# EAGLE schematic EIT_Recorder (EAGLE 9.6.2)

## Sheet 1 of 4: POWER_MANAGEMENT_1
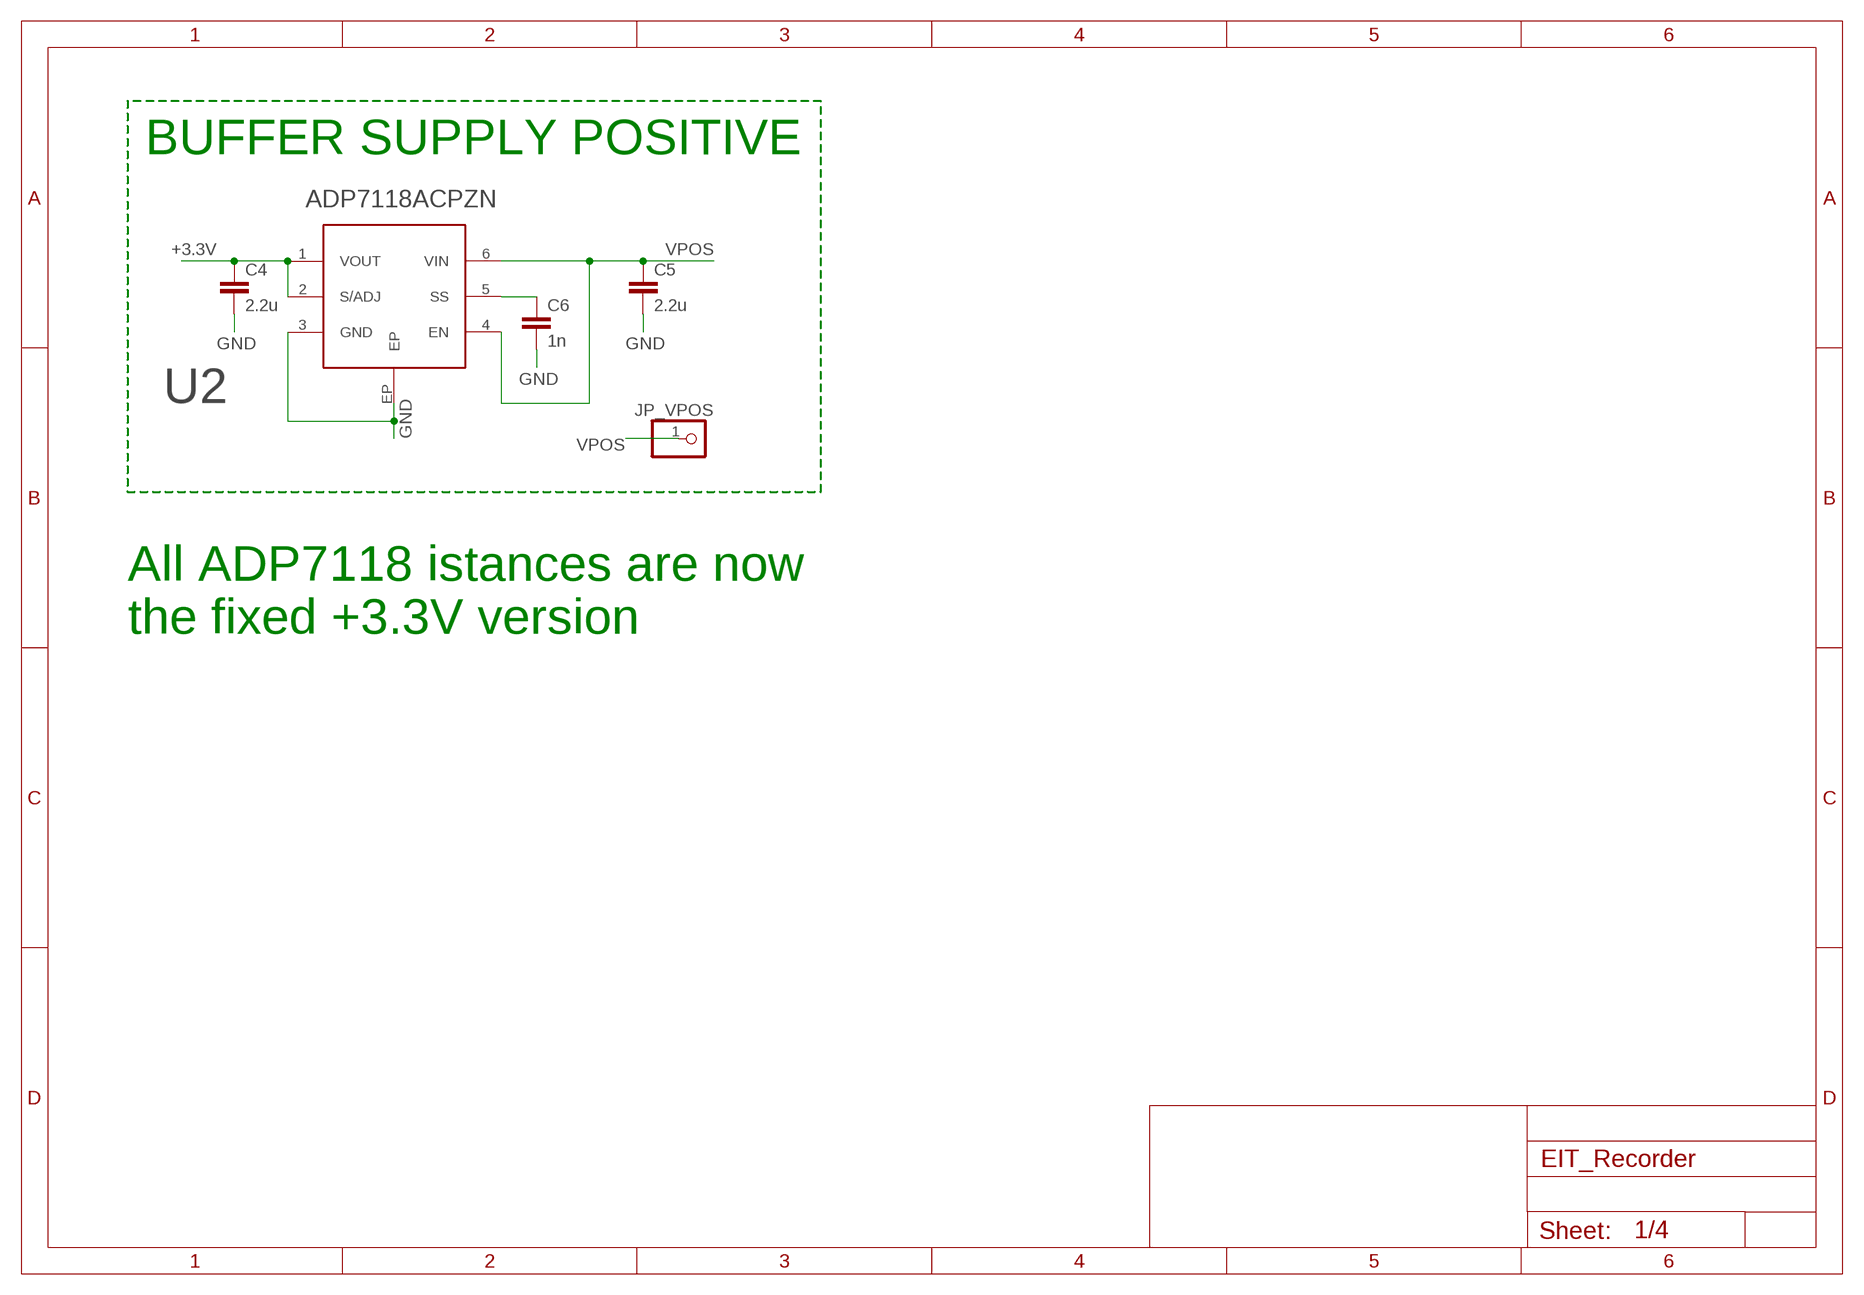
[diagram p0: schematic, sheet 1]

### Parts
C4  2.2u  C0603  [C0603]
C5  2.2u  C0603  [C0603]
C6  1n  C0402  [C0402]
JP_VPOS  PINHD-1X1  [1X01]
U2  ADP7118ACPZN  [LFCSP6_CUSTOM]

### Nets
+3.3V: C4.1 U2.1(VOUT) U2.2(S/ADJ) ; also sheet 3
GND: C4.2 C5.2 C6.2 U2.3(GND) U2.EP ; also sheet 2,3,4
N$7: C6.1 U2.5(SS)
VPOS: C5.1 JP_VPOS.1 U2.4(EN) U2.6(VIN) ; also sheet 2,4

### Notes on the sheet
- BUFFER SUPPLY POSITIVE
- All ADP7118 istances are now
  the fixed +3.3V version

## Sheet 2 of 4: POWER_MANAGEMENT_2
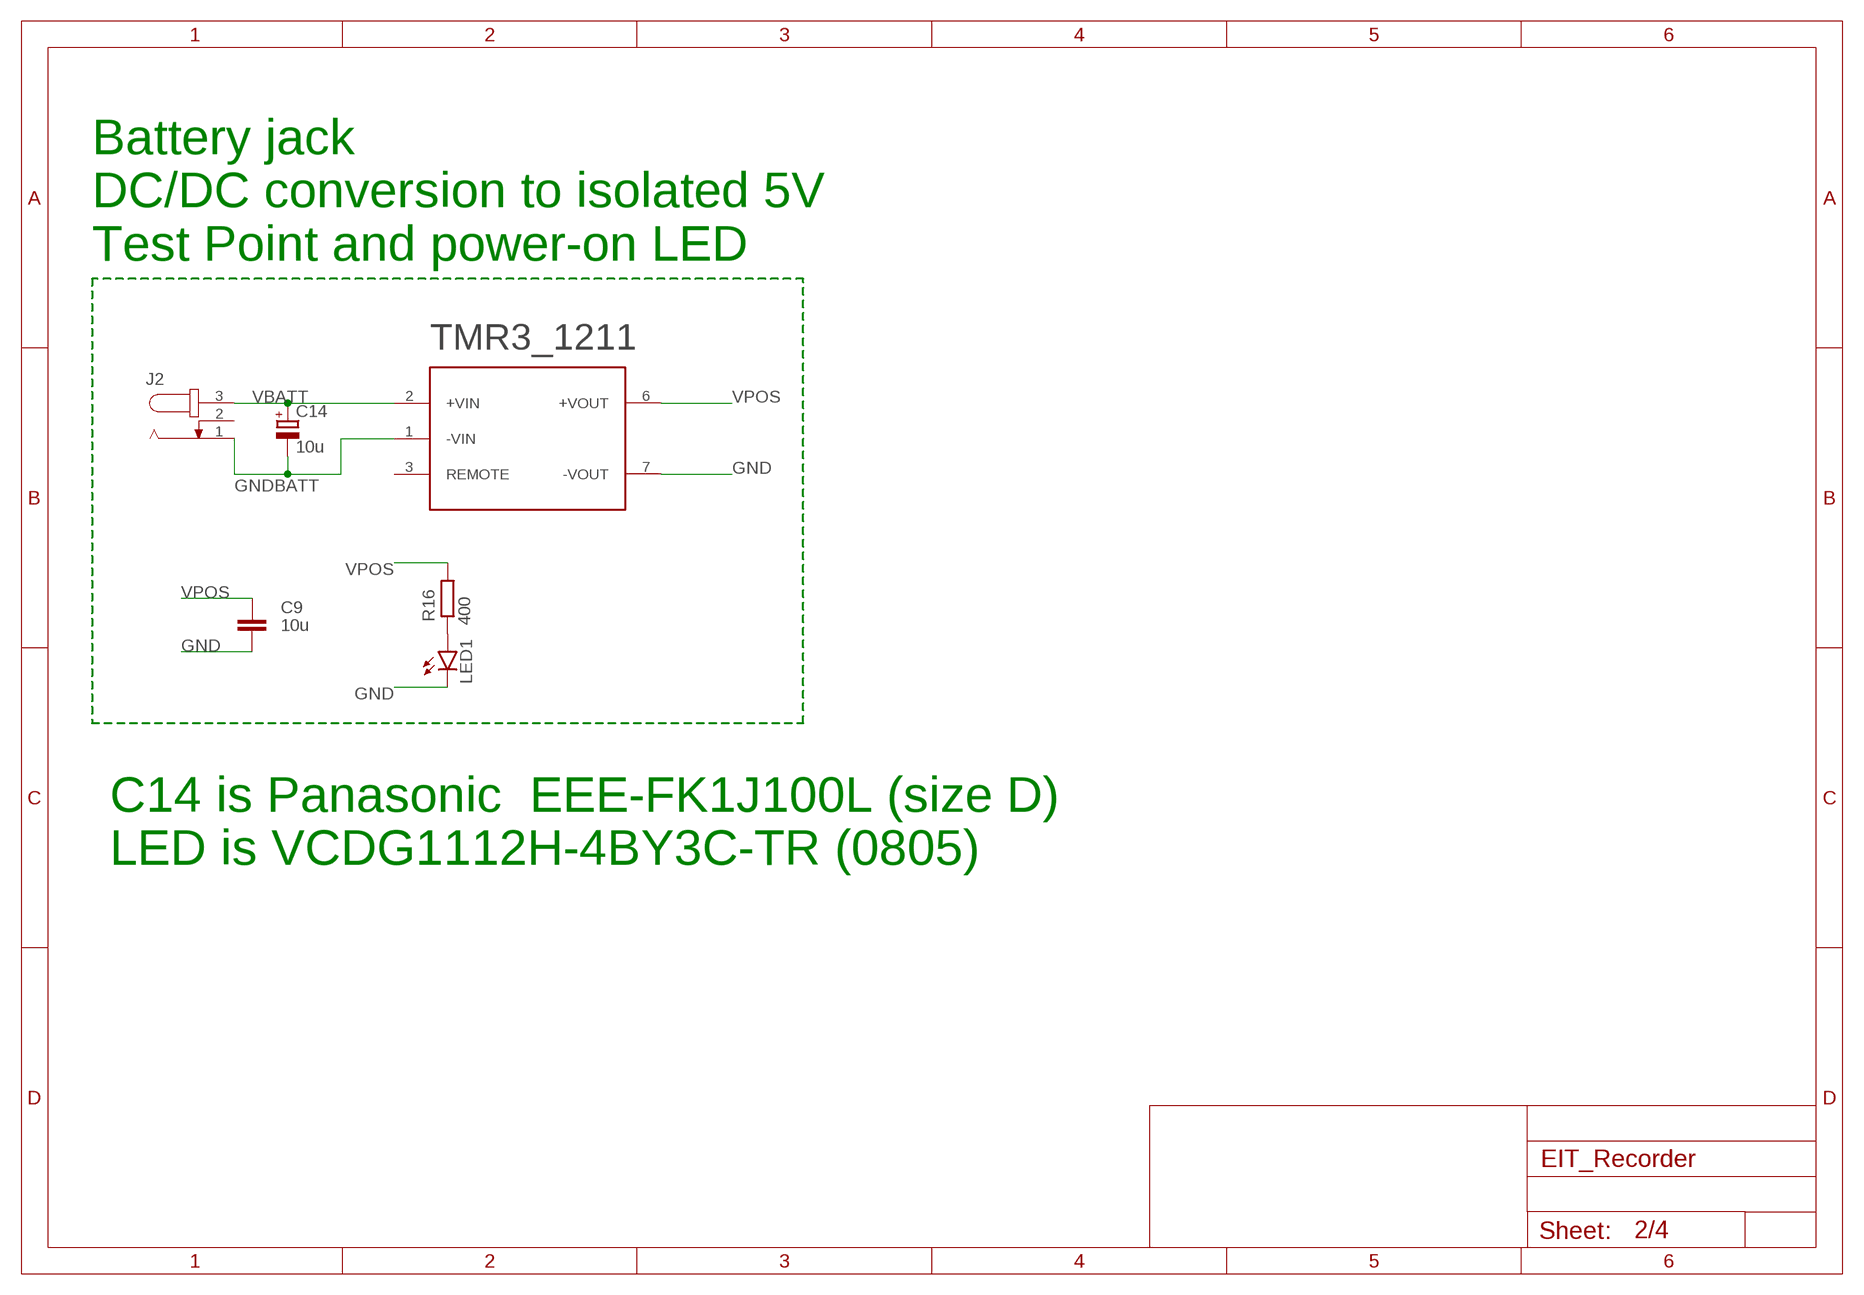
[diagram p1: schematic, sheet 2]

### Parts
C9  10u  C0805  [C0805]
C14  10u  CPOL-EUD  [PANASONIC_D]
J2  JACK-PLUG0  [SPC4077]
LED1  LEDCHIP-LED0805  [CHIP-LED0805]
R16  400  R-EU_R0805  [R0805]
TMR3_1211  TMR3_1211  [TMR3_1211]

### Nets
GND: C9.2 LED1.C TMR3_1211.7(-VOUT) ; also sheet 1,3,4
GNDBATT: C14.- J2.1 TMR3_1211.1(-VIN)
N$6: LED1.A R16.1
VBATT: C14.+ J2.3 TMR3_1211.2(+VIN)
VPOS: C9.1 R16.2 TMR3_1211.6(+VOUT) ; also sheet 1,4
Unconnected: J2.2 TMR3_1211.3(REMOTE)

### Notes on the sheet
- Battery jack
  DC/DC conversion to isolated 5V
  Test Point and power-on LED
- C14 is Panasonic  EEE-FK1J100L (size D)
  LED is VCDG1112H-4BY3C-TR (0805)

## Sheet 3 of 4: BUFFERS_AND_VREF
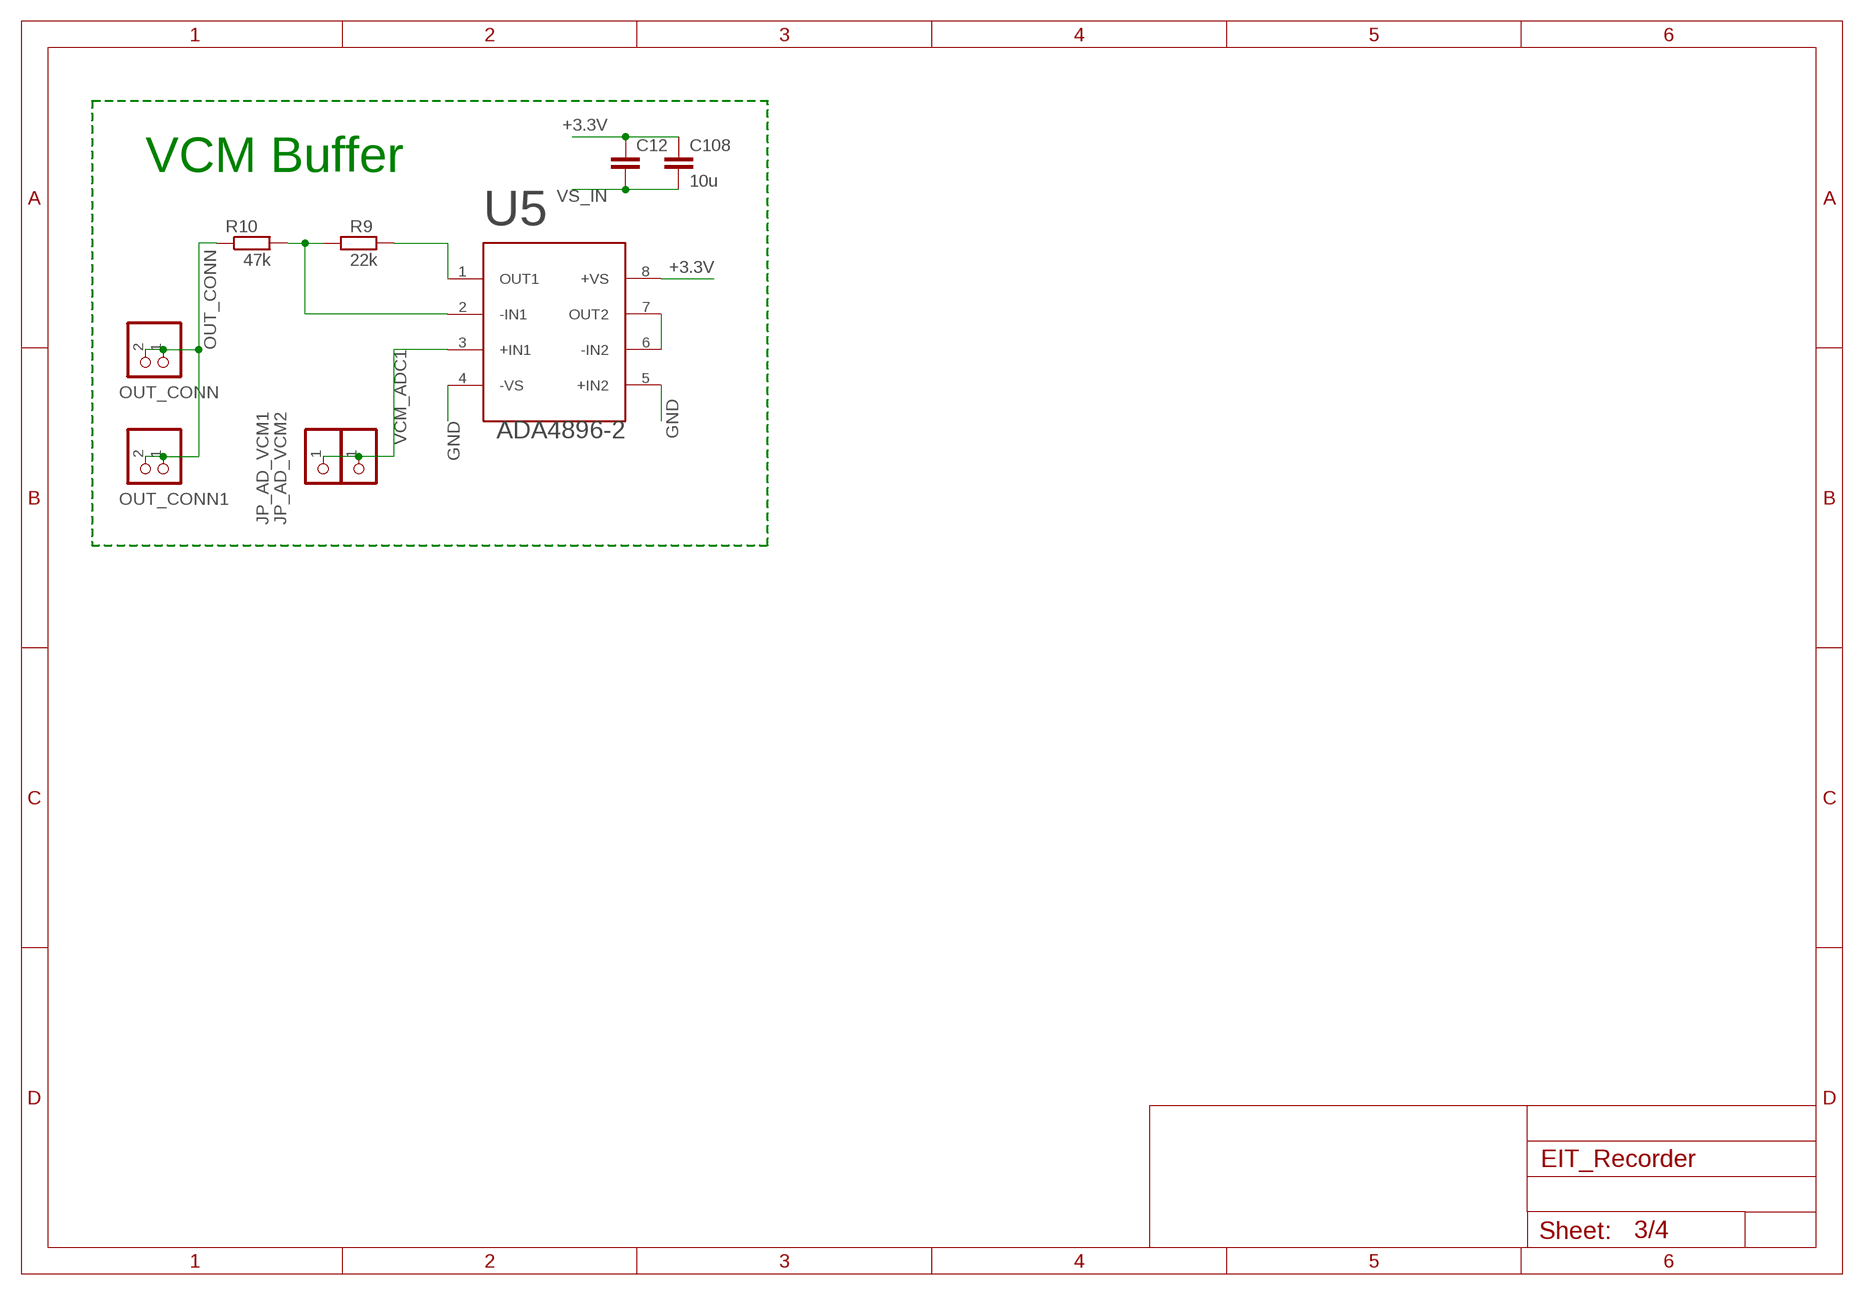
[diagram p2: schematic, sheet 3]

### Parts
C12  0.1u  C0402  [C0402]
C108  10u  C0805  [C0805]
JP_AD_VCM1  PINHD-1X1  [1X01]
JP_AD_VCM2  PINHD-1X1  [1X01]
OUT_CONN  PINHD-1X2  [1X02]
OUT_CONN1  PINHD-1X2  [1X02]
R9  22k  R0603  [R0603]
R10  47k  R0603  [R0603]
U5  ADA4896-2  [MSOP8_CUSTOM]

### Nets
+3.3V: C12.1 C108.1 U5.8(+VS) ; also sheet 1
GND: U5.4(-VS) U5.5(+IN2) ; also sheet 1,2,4
N$14: U5.6(-IN2) U5.7(OUT2)
N$20: R9.2 U5.1(OUT1)
N$22: R9.1 R10.2 U5.2(-IN1)
OUT_CONN: OUT_CONN1.1 OUT_CONN1.2 OUT_CONN.1 OUT_CONN.2 R10.1
VCM_ADC1: JP_AD_VCM1.1 JP_AD_VCM2.1 U5.3(+IN1)
VS_IN: C12.2 C108.2

### Notes on the sheet
- VCM Buffer

## Sheet 4 of 4: TOP BOARD CONNECTOR MATCHING
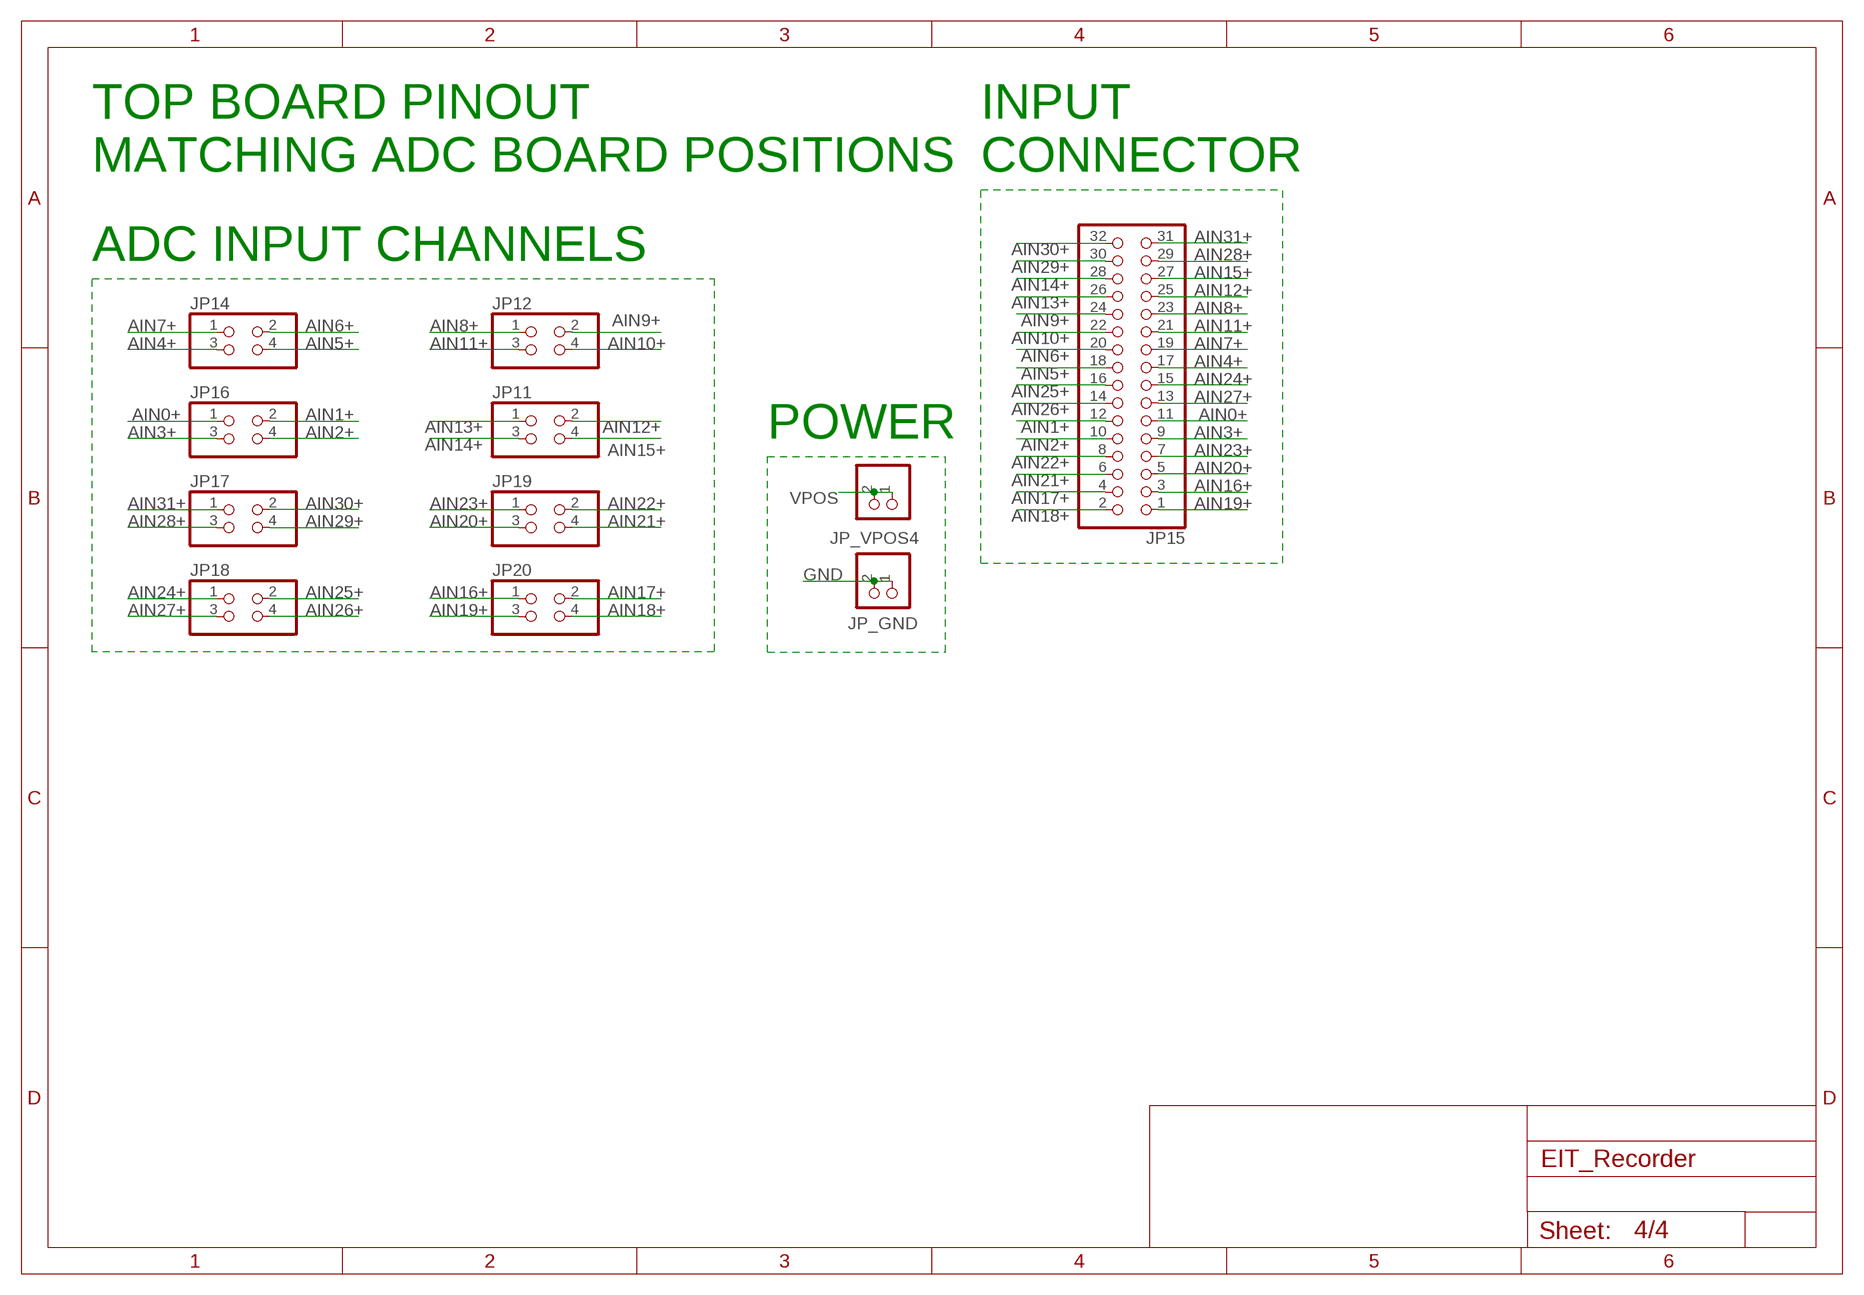
[diagram p3: schematic, sheet 4]

### Parts
JP11  PINHD-2X2  [2X02]
JP12  PINHD-2X2  [2X02]
JP14  PINHD-2X2  [2X02]
JP15  PINHD-2X16  [2X16]
JP16  PINHD-2X2  [2X02]
JP17  PINHD-2X2  [2X02]
JP18  PINHD-2X2  [2X02]
JP19  PINHD-2X2  [2X02]
JP20  PINHD-2X2  [2X02]
JP_GND  PINHD-1X2  [1X02]
JP_VPOS4  PINHD-1X2  [1X02]

### Nets
AIN0+: JP15.11 JP16.1
AIN1+: JP15.12 JP16.2
AIN2+: JP15.10 JP16.4
AIN3+: JP15.9 JP16.3
AIN4+: JP14.3 JP15.17
AIN5+: JP14.4 JP15.18
AIN6+: JP14.2 JP15.20
AIN7+: JP14.1 JP15.19
AIN8+: JP12.1 JP15.23
AIN9+: JP12.2 JP15.24
AIN10+: JP12.4 JP15.22
AIN11+: JP12.3 JP15.21
AIN12+: JP11.2 JP15.25
AIN13+: JP11.1 JP15.26
AIN14+: JP11.3 JP15.28
AIN15+: JP11.4 JP15.27
AIN16+: JP15.3 JP20.1
AIN17+: JP15.4 JP20.2
AIN18+: JP15.2 JP20.4
AIN19+: JP15.1 JP20.3
AIN20+: JP15.5 JP19.3
AIN21+: JP15.6 JP19.4
AIN22+: JP15.8 JP19.2
AIN23+: JP15.7 JP19.1
AIN24+: JP15.15 JP18.1
AIN25+: JP15.16 JP18.2
AIN26+: JP15.14 JP18.4
AIN27+: JP15.13 JP18.3
AIN28+: JP15.29 JP17.3
AIN29+: JP15.30 JP17.4
AIN30+: JP15.32 JP17.2
AIN31+: JP15.31 JP17.1
GND: JP_GND.1 JP_GND.2 ; also sheet 1,2,3
VPOS: JP_VPOS4.1 JP_VPOS4.2 ; also sheet 1,2

### Notes on the sheet
- TOP BOARD PINOUT 
  MATCHING ADC BOARD POSITIONS
- INPUT 
  CONNECTOR
- ADC INPUT CHANNELS
- POWER

## Library data of the parts
C4 C5 = EIT_Recorder:C0603
C6 C12 = EIT_Recorder:C0402
C9 C108 = EIT_Recorder:C0805
C14 = rcl:CPOL-EU: POLARIZED CAPACITOR, European symbol; SPICEPREFIX: C
J2 = con-jack:JACK-PLUG: DC POWER JACK Power Jack, DC, Right Angle, Through Hole, Rated 5A at 16VDC, PC Terminals Distributor: Farnell (www.Farnell.de) Drawing: 84N1161.pdf / 84N1162.pdf Manufacturer: SPC Technology (www.spctechnology.com) Type: SPC4077 / SPC 4078; OC_FARNELL: unknown; OC_NEWARK: unknown
JP11 JP12 JP14 JP16-JP20 = pinhead:PINHD-2X2: PIN HEADER
JP15 = pinhead:PINHD-2X16: PIN HEADER
JP_AD_VCM1 JP_AD_VCM2 JP_VPOS = pinhead:PINHD-1X1: PIN HEADER
JP_GND JP_VPOS4 OUT_CONN OUT_CONN1 = pinhead:PINHD-1X2: PIN HEADER
LED1 = led:LED: LED OSRAM: - CHIPLED LG R971, LG N971, LY N971, LG Q971, LY Q971, LO R971, LY R971 LH N974, LH R974 LS Q976, LO Q976, LY Q976 LO Q996 - Hyper CHIPLED LW Q18S LB Q993, LB Q99A, LB R99A - SideLED LS A670, LO A670, LY A670, LG A670, LP A670 LB A673, LV A673, LT A673, LW A673 LH A674 LY A675 LS A676, LA A676, LO A676, LY A676, LW A676 LS A679, LY A679, LG A679 - Hyper Micro SIDELED® LS Y876, LA Y876, LO Y876, LY Y876 LT Y87S - SmartLED LW L88C, LW L88S LB L89C, LB L89S, LG L890 LS L89K, LO L89K, LY L89K LS L896, LA L896, LO L896, LY L896 - TOPLED LS T670, LO T670, LY T670, LG T670, LP T670 LSG T670, LSP T670, LSY T670, LOP T670, LYG T670 LG T671, LOG T671, LSG T671 LB T673, LV T673, LT T673, LW T673 LH T674 LS T676, LA T676, LO T676, LY T676, LB T676, LH T676, LSB T676, LW T676 LB T67C, LV T67C, LT T67C, LS T67K, LO T67K, LY T67K, LW E67C LS E67B, LA E67B, LO E67B, LY E67B, LB E67C, LV E67C, LT E67C LW T67C LS T679, LY T679, LG T679 LS T770, LO T770, LY T770, LG T770, LP T770 LB T773, LV T773, LT T773, LW T773 LH T774 LS E675, LA E675, LY E675, LS T675 LS T776, LA T776, LO T776, LY T776, LB T776 LHGB T686 LT T68C, LB T68C - Hyper Mini TOPLED® LB M676 - Mini TOPLED Santana® LG M470 LS M47K, LO M47K, LY M47K Source: http://www.osram.convergy.de LUXEON: - LUMILED® LXK2-PW12-R00, LXK2-PW12-S00, LXK2-PW14-U00, LXK2-PW14-V00 LXK2-PM12-R00, LXK2-PM12-S00, LXK2-PM14-U00 LXK2-PE12-Q00, LXK2-PE12-R00, LXK2-PE12-S00, LXK2-PE14-T00, LXK2-PE14-U00 LXK2-PB12-K00, LXK2-PB12-L00, LXK2-PB12-M00, LXK2-PB14-N00, LXK2-PB14-P00, LXK2-PB14-Q00 LXK2-PR12-L00, LXK2-PR12-M00, LXK2-PR14-Q00, LXK2-PR14-R00 LXK2-PD12-Q00, LXK2-PD12-R00, LXK2-PD12-S00 LXK2-PH12-R00, LXK2-PH12-S00 LXK2-PL12-P00, LXK2-PL12-Q00, LXK2-PL12-R00 Source: www.luxeon.com KINGBRIGHT: KA-3528ASYC Source: www.kingbright.com
R9 R10 = EIT_Recorder:R0603
R16 = rcl:R-EU_: RESISTOR, European symbol; SPICEPREFIX: R
TMR3_1211 = EIT_Recorder:TMR3_1211
U2 = EIT_Recorder:ADP7118ACPZN
U5 = EIT_Recorder:ADA4896-2